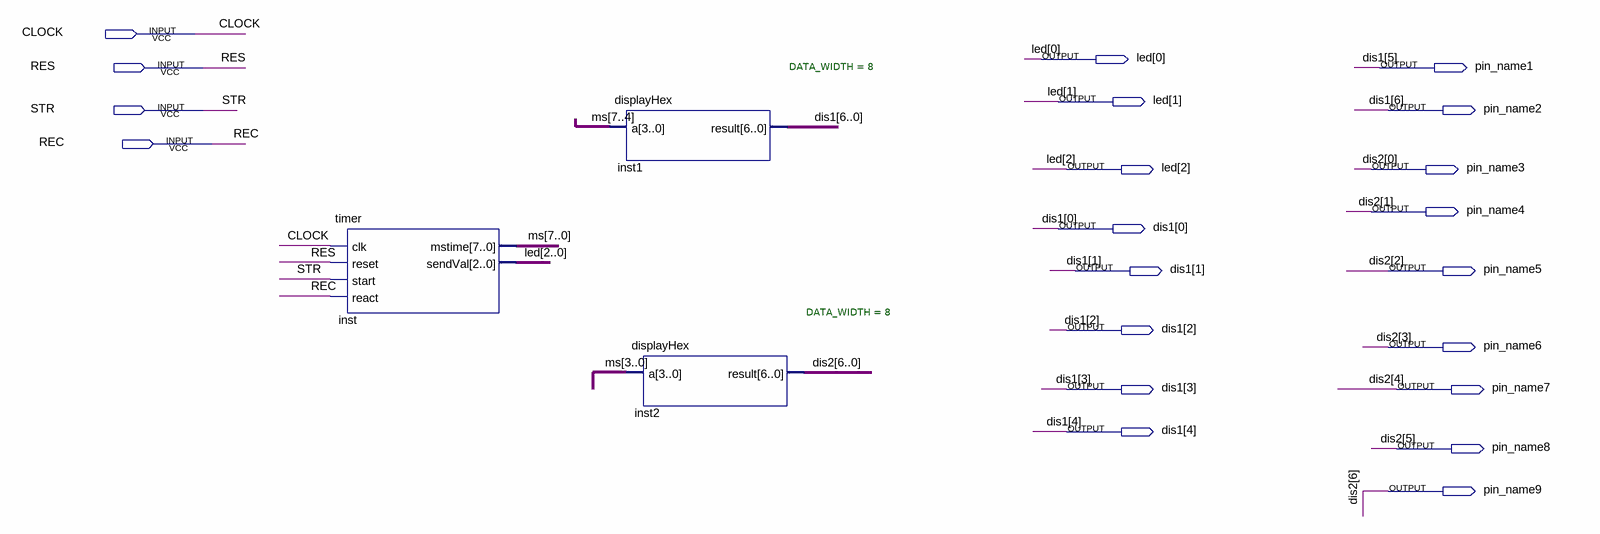
[diagram p0: schematic sheet]
// Quartus schematic reaction.bdf as structural Verilog: 3 symbols, 21 pins
module reaction (
  input  CLOCK,
  input  RES,
  input  STR,
  input  REC,
  output [2:0] led,
  output pin_name1,
  output pin_name2,
  output pin_name3,
  output pin_name4,
  output [4:0] dis1,
  output pin_name5,
  output pin_name6,
  output pin_name7,
  output pin_name8,
  output pin_name9
);

  wire [7:0] ms;

  timer inst (.clk(CLOCK), .reset(RES), .start(STR), .react(REC), .mstime(ms), .sendVal(led));
  displayHex #(.DATA_WIDTH(8)) inst1 (.a(ms[7:4]), .result({pin_name2, pin_name1, dis1}));
  displayHex #(.DATA_WIDTH(8)) inst2 (
    .a(ms[3:0]), .result({pin_name9, pin_name8, pin_name7, pin_name6, pin_name5, pin_name4, pin_name3}));

  // Other names for the same wires on the sheet: dis1[6:5] = {pin_name2, pin_name1};
  //   dis2[6:0] = {pin_name9, pin_name8, pin_name7, pin_name6, pin_name5, pin_name4, pin_name3}
endmodule
